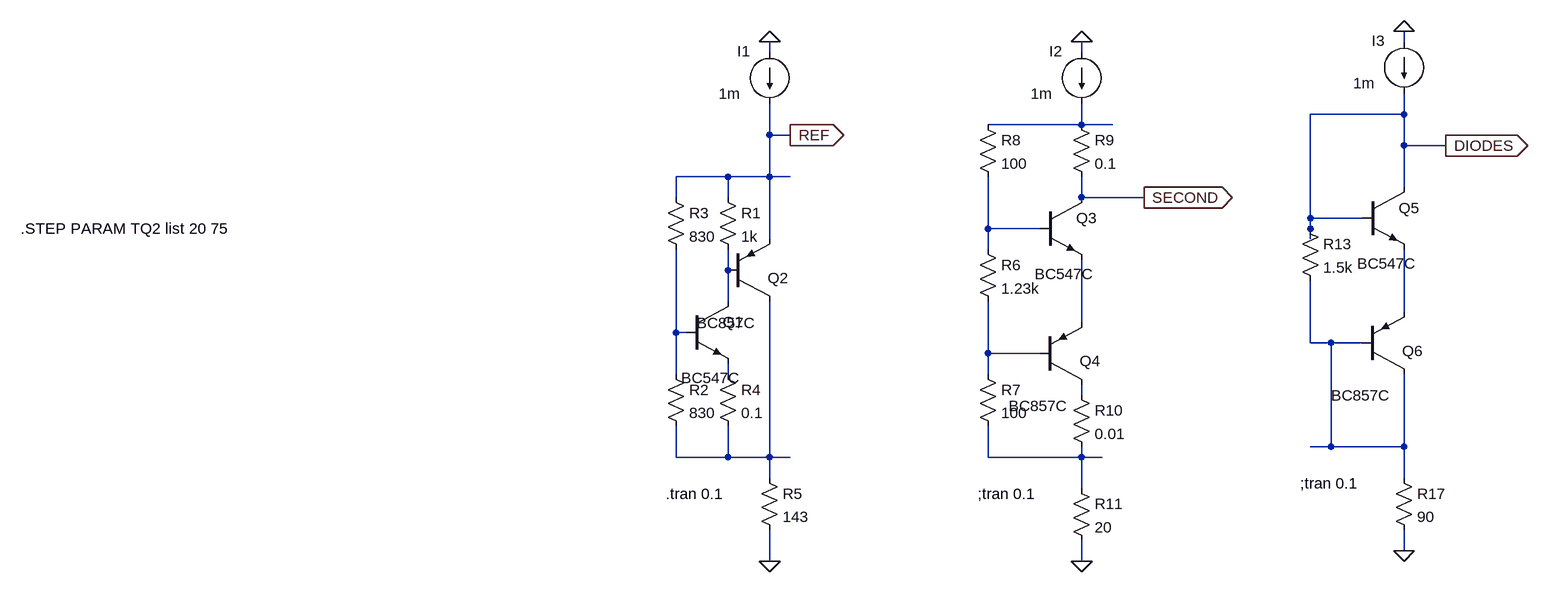
[diagram p0: schematic vbe_multiplier_2.asc]
vbe_multiplier_2.asc, the LTspice schematic file:
Version 4
SHEET 1 1404 692
WIRE 1152 -256 1152 -272
WIRE 176 -240 176 -256
WIRE 656 -240 656 -256
WIRE 1152 -144 1152 -176
WIRE 1152 -144 1008 -144
WIRE 656 -128 656 -160
WIRE 656 -128 512 -128
WIRE 704 -128 656 -128
WIRE 176 -112 176 -160
WIRE 208 -112 176 -112
WIRE 1152 -96 1152 -144
WIRE 1216 -96 1152 -96
WIRE 112 -48 32 -48
WIRE 176 -48 176 -112
WIRE 176 -48 112 -48
WIRE 208 -48 176 -48
WIRE 1152 -32 1152 -96
WIRE 32 -16 32 -48
WIRE 112 -16 112 -48
WIRE 656 -16 656 -48
WIRE 752 -16 656 -16
WIRE 1008 16 1008 -144
WIRE 1088 16 1008 16
WIRE 512 32 512 -48
WIRE 592 32 512 32
WIRE 1008 32 1008 16
WIRE 176 48 176 -48
WIRE 1008 48 1008 32
WIRE 512 64 512 32
WIRE 112 96 112 64
WIRE 112 144 112 96
WIRE 1152 160 1152 64
WIRE 656 176 656 80
WIRE 32 192 32 64
WIRE 48 192 32 192
WIRE 1008 208 1008 112
WIRE 1040 208 1008 208
WIRE 1088 208 1040 208
WIRE 512 224 512 144
WIRE 592 224 512 224
WIRE 32 256 32 192
WIRE 112 256 112 240
WIRE 512 256 512 224
WIRE 656 288 656 272
WIRE 1040 368 1040 208
WIRE 1040 368 1008 368
WIRE 1152 368 1152 256
WIRE 1152 368 1040 368
WIRE 32 384 32 336
WIRE 112 384 112 336
WIRE 112 384 32 384
WIRE 176 384 176 144
WIRE 176 384 112 384
WIRE 208 384 176 384
WIRE 512 384 512 336
WIRE 656 384 656 368
WIRE 656 384 512 384
WIRE 688 384 656 384
WIRE 176 416 176 384
WIRE 1152 416 1152 368
WIRE 656 432 656 384
WIRE 1152 528 1152 496
WIRE 176 544 176 496
WIRE 656 544 656 512
FLAG 176 -256 0
FLAG 176 544 0
FLAG 656 -256 0
FLAG 656 544 0
FLAG 208 -112 REF
IOPIN 208 -112 Out
FLAG 752 -16 SECOND
IOPIN 752 -16 Out
FLAG 1152 -272 0
FLAG 1152 528 0
FLAG 1216 -96 DIODES
IOPIN 1216 -96 Out
SYMBOL npn 48 144 R0
WINDOW 3 -8 118 Left 2
SYMATTR Value BC547C
SYMATTR InstName Q1
SYMATTR SpiceLine TEMP {TQ2}
SYMBOL pnp 112 144 M180
WINDOW 0 61 36 Left 2
WINDOW 3 -48 -33 Left 2
SYMATTR InstName Q2
SYMATTR Value BC857C
SYMATTR SpiceLine TEMP {TQ2}
SYMBOL res 96 -32 R0
SYMATTR InstName R1
SYMATTR Value 1k
SYMBOL res 16 240 R0
SYMATTR InstName R2
SYMATTR Value 830
SYMBOL res 16 -32 R0
SYMATTR InstName R3
SYMATTR Value 830
SYMBOL current 176 -240 R0
WINDOW 0 -50 -1 Left 2
WINDOW 3 -78 64 Left 2
WINDOW 123 0 0 Left 0
WINDOW 39 0 0 Left 0
SYMATTR InstName I1
SYMATTR Value 1m
SYMBOL res 96 240 R0
SYMATTR InstName R4
SYMATTR Value 0.1
SYMBOL res 160 400 R0
SYMATTR InstName R5
SYMATTR Value 143
SYMBOL npn 592 -16 R0
WINDOW 3 -8 118 Left 2
SYMATTR Value BC547C
SYMATTR InstName Q3
SYMATTR SpiceLine TEMP {TQ2}
SYMBOL pnp 592 272 M180
WINDOW 0 61 36 Left 2
WINDOW 3 -48 -33 Left 2
SYMATTR InstName Q4
SYMATTR Value BC857C
SYMATTR SpiceLine TEMP {TQ2}
SYMBOL res 496 240 R0
SYMATTR InstName R7
SYMATTR Value 100
SYMBOL current 656 -240 R0
WINDOW 0 -50 -1 Left 2
WINDOW 3 -78 64 Left 2
WINDOW 123 0 0 Left 0
WINDOW 39 0 0 Left 0
SYMATTR InstName I2
SYMATTR Value 1m
SYMBOL res 496 48 R0
SYMATTR InstName R6
SYMATTR Value 1.23k
SYMBOL res 496 -144 R0
SYMATTR InstName R8
SYMATTR Value 100
SYMBOL res 640 -144 R0
SYMATTR InstName R9
SYMATTR Value 0.1
SYMBOL res 640 272 R0
SYMATTR InstName R10
SYMATTR Value 0.01
SYMBOL res 640 416 R0
SYMATTR InstName R11
SYMATTR Value 20
SYMBOL npn 1088 -32 R0
WINDOW 3 -8 118 Left 2
SYMATTR Value BC547C
SYMATTR InstName Q5
SYMATTR SpiceLine TEMP {TQ2}
SYMBOL pnp 1088 256 M180
WINDOW 0 61 36 Left 2
WINDOW 3 -48 -33 Left 2
SYMATTR InstName Q6
SYMATTR Value BC857C
SYMATTR SpiceLine TEMP {TQ2}
SYMBOL current 1152 -256 R0
WINDOW 0 -50 -1 Left 2
WINDOW 3 -78 64 Left 2
WINDOW 123 0 0 Left 0
WINDOW 39 0 0 Left 0
SYMATTR InstName I3
SYMATTR Value 1m
SYMBOL res 1136 400 R0
SYMATTR InstName R17
SYMATTR Value 90
SYMBOL res 992 16 R0
SYMATTR InstName R13
SYMATTR Value 1.5k
TEXT 16 440 Left 2 !.tran 0.1
TEXT -976 32 Left 2 !.STEP PARAM TQ2 list 20 75
TEXT 496 440 Left 2 !;tran 0.1
TEXT 992 424 Left 2 !;tran 0.1

The netlist it stands for:
* vbe_multiplier_2.asc
Q1 N003 N006 N009 0 BC547C TEMP {TQ2}
Q2 N011 N003 REF 0 BC857C TEMP {TQ2}
R1 REF N003 1k
R2 N006 N011 830
R3 REF N006 830
I1 0 REF 1m
R4 N009 N011 0.1
R5 N011 0 143
Q3 SECOND N002 N005 0 BC547C TEMP {TQ2}
Q4 N010 N008 N005 0 BC857C TEMP {TQ2}
R7 N008 N012 100
I2 0 N001 1m
R6 N002 N008 1.23k
R8 N001 N002 100
R9 N001 SECOND 0.1
R10 N010 N012 0.01
R11 N012 0 20
Q5 DIODES DIODES N004 0 BC547C TEMP {TQ2}
Q6 N007 N007 N004 0 BC857C TEMP {TQ2}
I3 0 DIODES 1m
R17 N007 0 90
R13 DIODES N007 1.5k
.model NPN NPN
.model PNP PNP
.lib standard.bjt
.tran 0.1
.STEP PARAM TQ2 list 20 75
;tran 0.1
;tran 0.1
.backanno
.end